# Altium schematic sheet Ch1and2.SchDoc
size A
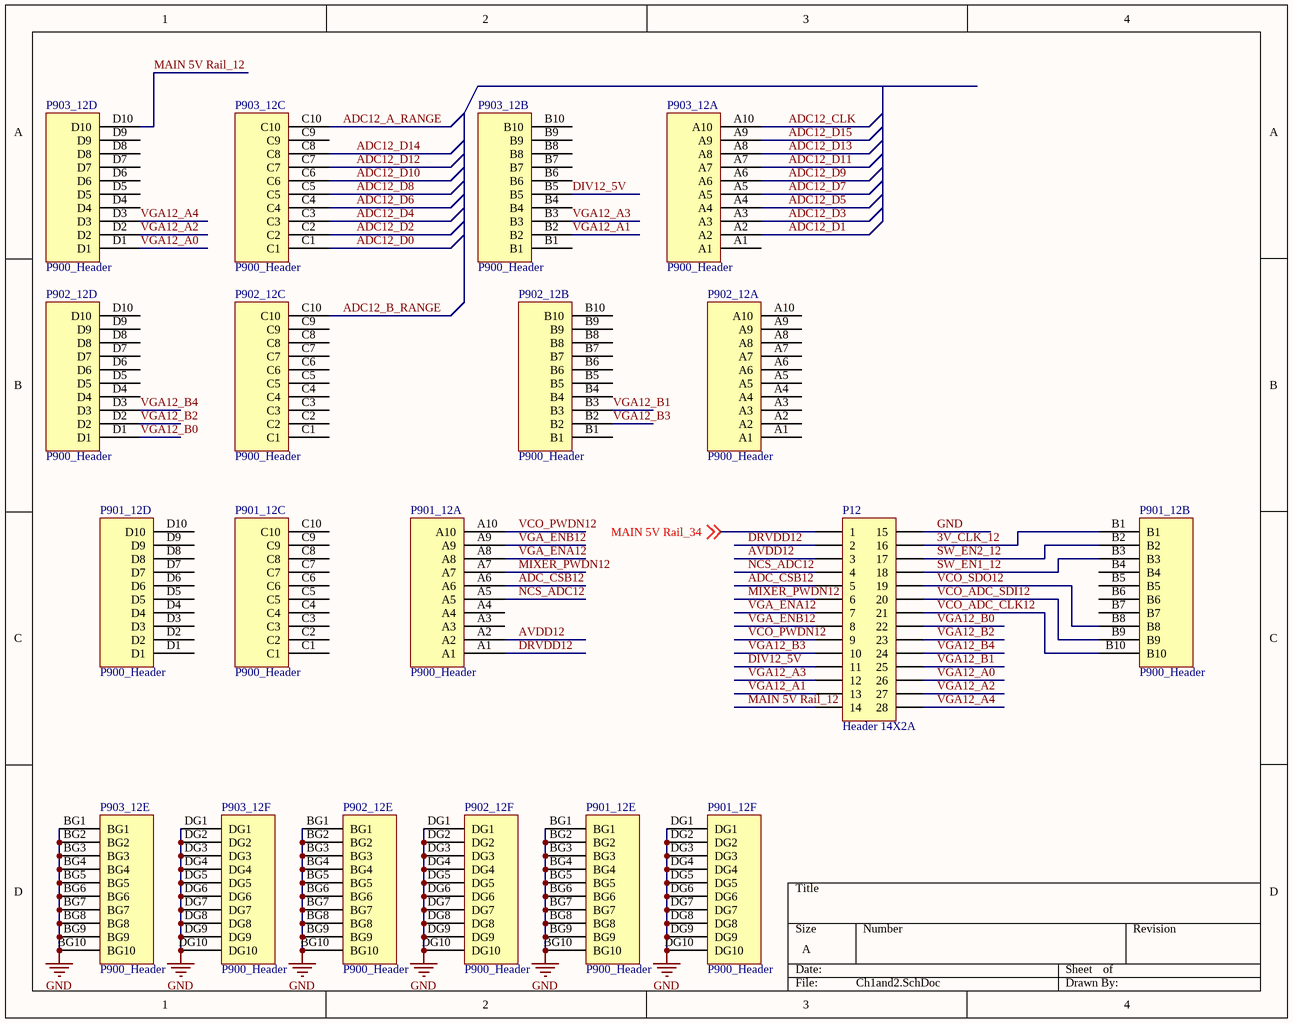
[diagram p0: Ch1and2.SchDoc]

## Parts
P12  Header 14X2A  [HDR2X14_CEN]
P901_12  P900_Header  [P900_header]  (parts A,B,C,D,E,F of 6)
P902_12  P900_Header  [P900_header]  (parts A,B,C,D,E,F of 6)
P903_12  P900_Header  [P900_header]  (parts A,B,C,D,E,F of 6)

## Nets
GND: P12.15 P901_12.BG1 P901_12.BG2 P901_12.BG3 P901_12.BG4 P901_12.BG5 P901_12.BG6 P901_12.BG7 P901_12.BG8 P901_12.BG9 P901_12.BG10 P901_12.DG1 P901_12.DG2 P901_12.DG3 P901_12.DG4 P901_12.DG5 P901_12.DG6 P901_12.DG7 P901_12.DG8 P901_12.DG9 P901_12.DG10 P902_12.BG1 P902_12.BG2 P902_12.BG3 P902_12.BG4 P902_12.BG5 P902_12.BG6 P902_12.BG7 P902_12.BG8 P902_12.BG9 P902_12.BG10 P902_12.DG1 P902_12.DG2 P902_12.DG3 P902_12.DG4 P902_12.DG5 P902_12.DG6 P902_12.DG7 P902_12.DG8 P902_12.DG9 P902_12.DG10 P903_12.BG1 P903_12.BG2 P903_12.BG3 P903_12.BG4 P903_12.BG5 P903_12.BG6 P903_12.BG7 P903_12.BG8 P903_12.BG9 P903_12.BG10 P903_12.DG1 P903_12.DG2 P903_12.DG3 P903_12.DG4 P903_12.DG5 P903_12.DG6 P903_12.DG7 P903_12.DG8 P903_12.DG9 P903_12.DG10
3V_CLK_12: P12.16 P901_12.B1
ADC12_A_RANGE: P903_12.C10
ADC12_B_RANGE: P902_12.C10
ADC12_CLK: P903_12.A10
ADC12_D0: P903_12.C1
ADC12_D1: P903_12.A2
ADC12_D2: P903_12.C2
ADC12_D3: P903_12.A3
ADC12_D4: P903_12.C3
ADC12_D5: P903_12.A4
ADC12_D6: P903_12.C4
ADC12_D7: P903_12.A5
ADC12_D8: P903_12.C5
ADC12_D9: P903_12.A6
ADC12_D10: P903_12.C6
ADC12_D11: P903_12.A7
ADC12_D12: P903_12.C7
ADC12_D13: P903_12.A8
ADC12_D14: P903_12.C8
ADC12_D15: P903_12.A9
ADC_CSB12: P12.5 P901_12.A6
AVDD12: P12.3 P901_12.A2
DIV12_5V: P12.11 P903_12.B5
DRVDD12: P12.2 P901_12.A1
MAIN 5V Rail_12: P12.14 P903_12.D10
MAIN 5V Rail_34: P12.1 ; off-sheet MAIN 5V Rail_34
MIXER_PWDN12: P12.6 P901_12.A7
NCS_ADC12: P12.4 P901_12.A5
SW_EN1_12: P12.18 P901_12.B3
SW_EN2_12: P12.17 P901_12.B2
VCO_ADC_CLK12: P12.21 P901_12.B10
VCO_ADC_SDI12: P12.20 P901_12.B9
VCO_PWDN12: P12.9 P901_12.A10
VCO_SDO12: P12.19 P901_12.B8
VGA12_A0: P12.26 P903_12.D1
VGA12_A1: P12.13 P903_12.B2
VGA12_A2: P12.27 P903_12.D2
VGA12_A3: P12.12 P903_12.B3
VGA12_A4: P12.28 P903_12.D3
VGA12_B0: P12.22 P902_12.D1
VGA12_B1: P12.25 P902_12.B3
VGA12_B2: P12.23 P902_12.D2
VGA12_B3: P12.10 P902_12.B2
VGA12_B4: P12.24 P902_12.D3
VGA_ENA12: P12.7 P901_12.A8
VGA_ENB12: P12.8 P901_12.A9

Not connected (* = marked no-connect by the designer): P901_12 A3 A4 B4 B5 B6 B7 C1 C2 C3 C4 C5 C6 C7 C8 C9 C10 D1 D2 D3 D4 D5 D6 D7 D8 D9 D10; P902_12 A1 A2 A3 A4 A5 A6 A7 A8 A9 A10 B1 B4 B5 B6 B7 B8 B9 B10 C1 C2 C3 C4 C5 C6 C7 C8 C9 D4 D5 D6 D7 D8 D9 D10; P903_12 A1 B1 B4 B6 B7 B8 B9 B10 C9 D4 D5 D6 D7 D8 D9

## Library data of the parts
P12 = Header 14X2A: Header, 14-Pin, Dual row; LatestRevisionDate: 17-Jul-2002; LatestRevisionNote: Re-released for DXP Platform.; Publisher: Altium Limited
P902_12 P903_12 = P900_Header: pin to pad: A1>ADC